# EAGLE design lab (EAGLE 7.7.0)
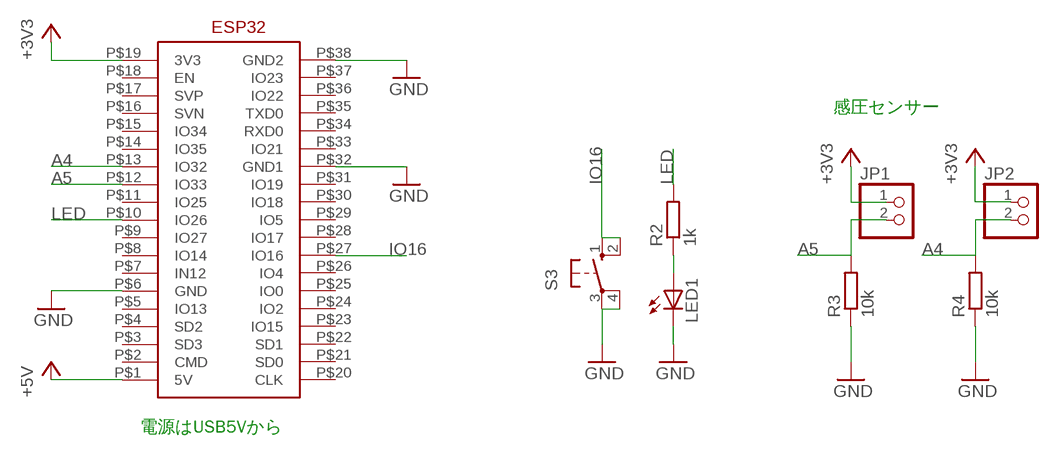
[diagram p0: schematic, sheet 1]

## Parts
JP1  PINHD-1X2  [1X02]
JP2  PINHD-1X2  [1X02]
LED1  LEDSML0603  [SML0603]
R2  1k  R-EU_0207/10  [0207/10]
R3  10k  R-EU_0207/10  [0207/10]
R4  10k  R-EU_0207/10  [0207/10]
S3  10-XX  [B3F-10XX]
U$1  ESP32_DEVKITC  [ESP32_DEVKITC]

## Nets
+3V3: JP1.1 JP2.1 U$1.P$19(3V3)
+5V [VCC]: U$1.P$1(5V)
+5V1 [VCC]: LED1.A R2.1
A4: JP2.2 R4.2 U$1.P$13(IO32)
A5: JP1.2 R3.2 U$1.P$12(IO33)
GND [GND]: LED1.C R3.1 R4.1 S3.3(P) S3.4(P1) U$1.P$6(GND) U$1.P$32(GND1) U$1.P$38(GND2)
IO16: S3.1(S) S3.2(S1) U$1.P$27(IO16)
LED: R2.2 U$1.P$10(IO26)
Unconnected: U$1.P$2(CMD) U$1.P$3(SD3) U$1.P$4(SD2) U$1.P$5(IO13) U$1.P$7(IN12) U$1.P$8(IO14) U$1.P$9(IO27) U$1.P$11(IO25) U$1.P$14(IO35) U$1.P$15(IO34) U$1.P$16(SVN) U$1.P$17(SVP) U$1.P$18(EN) U$1.P$20(CLK) U$1.P$21(SD0) U$1.P$22(SD1) U$1.P$23(IO15) U$1.P$24(IO2) U$1.P$25(IO0) U$1.P$26(IO4) U$1.P$28(IO17) U$1.P$29(IO5) U$1.P$30(IO18) U$1.P$31(IO19) U$1.P$33(IO21) U$1.P$34(RXD0) U$1.P$35(TXD0) U$1.P$36(IO22) U$1.P$37(IO23)

## Notes on the sheet
- 感圧センサー
- 電源はUSB5Vから

## Library data of the parts
JP1 JP2 = pinhead:PINHD-1X2: PIN HEADER
LED1 = led:LED: LED OSRAM: - CHIPLED LG R971, LG N971, LY N971, LG Q971, LY Q971, LO R971, LY R971 LH N974, LH R974 LS Q976, LO Q976, LY Q976 LO Q996 - Hyper CHIPLED LW Q18S LB Q993, LB Q99A, LB R99A - SideLED LS A670, LO A670, LY A670, LG A670, LP A670 LB A673, LV A673, LT A673, LW A673 LH A674 LY A675 LS A676, LA A676, LO A676, LY A676, LW A676 LS A679, LY A679, LG A679 - Hyper Micro SIDELED® LS Y876, LA Y876, LO Y876, LY Y876 LT Y87S - SmartLED LW L88C, LW L88S LB L89C, LB L89S, LG L890 LS L89K, LO L89K, LY L89K LS L896, LA L896, LO L896, LY L896 - TOPLED LS T670, LO T670, LY T670, LG T670, LP T670 LSG T670, LSP T670, LSY T670, LOP T670, LYG T670 LG T671, LOG T671, LSG T671 LB T673, LV T673, LT T673, LW T673 LH T674 LS T676, LA T676, LO T676, LY T676, LB T676, LH T676, LSB T676, LW T676 LB T67C, LV T67C, LT T67C, LS T67K, LO T67K, LY T67K, LW E67C LS E67B, LA E67B, LO E67B, LY E67B, LB E67C, LV E67C, LT E67C LW T67C LS T679, LY T679, LG T679 LS T770, LO T770, LY T770, LG T770, LP T770 LB T773, LV T773, LT T773, LW T773 LH T774 LS E675, LA E675, LY E675, LS T675 LS T776, LA T776, LO T776, LY T776, LB T776 LHGB T686 LT T68C, LB T68C - Hyper Mini TOPLED® LB M676 - Mini TOPLED Santana® LG M470 LS M47K, LO M47K, LY M47K Source: http://www.osram.convergy.de LUXEON: - LUMILED® LXK2-PW12-R00, LXK2-PW12-S00, LXK2-PW14-U00, LXK2-PW14-V00 LXK2-PM12-R00, LXK2-PM12-S00, LXK2-PM14-U00 LXK2-PE12-Q00, LXK2-PE12-R00, LXK2-PE12-S00, LXK2-PE14-T00, LXK2-PE14-U00 LXK2-PB12-K00, LXK2-PB12-L00, LXK2-PB12-M00, LXK2-PB14-N00, LXK2-PB14-P00, LXK2-PB14-Q00 LXK2-PR12-L00, LXK2-PR12-M00, LXK2-PR14-Q00, LXK2-PR14-R00 LXK2-PD12-Q00, LXK2-PD12-R00, LXK2-PD12-S00 LXK2-PH12-R00, LXK2-PH12-S00 LXK2-PL12-P00, LXK2-PL12-Q00, LXK2-PL12-R00 Source: www.luxeon.com KINGBRIGHT: KA-3528ASYC Source: www.kingbright.com
R2-R4 = rcl:R-EU_: RESISTOR, European symbol
S3 = switch-omron:10-XX: OMRON SWITCH; MPN: B3F-1000; OC_FARNELL: 176432; OC_NEWARK: 36M3542
U$1 = esp32-devkit:ESP32_DEVKITC

## Board
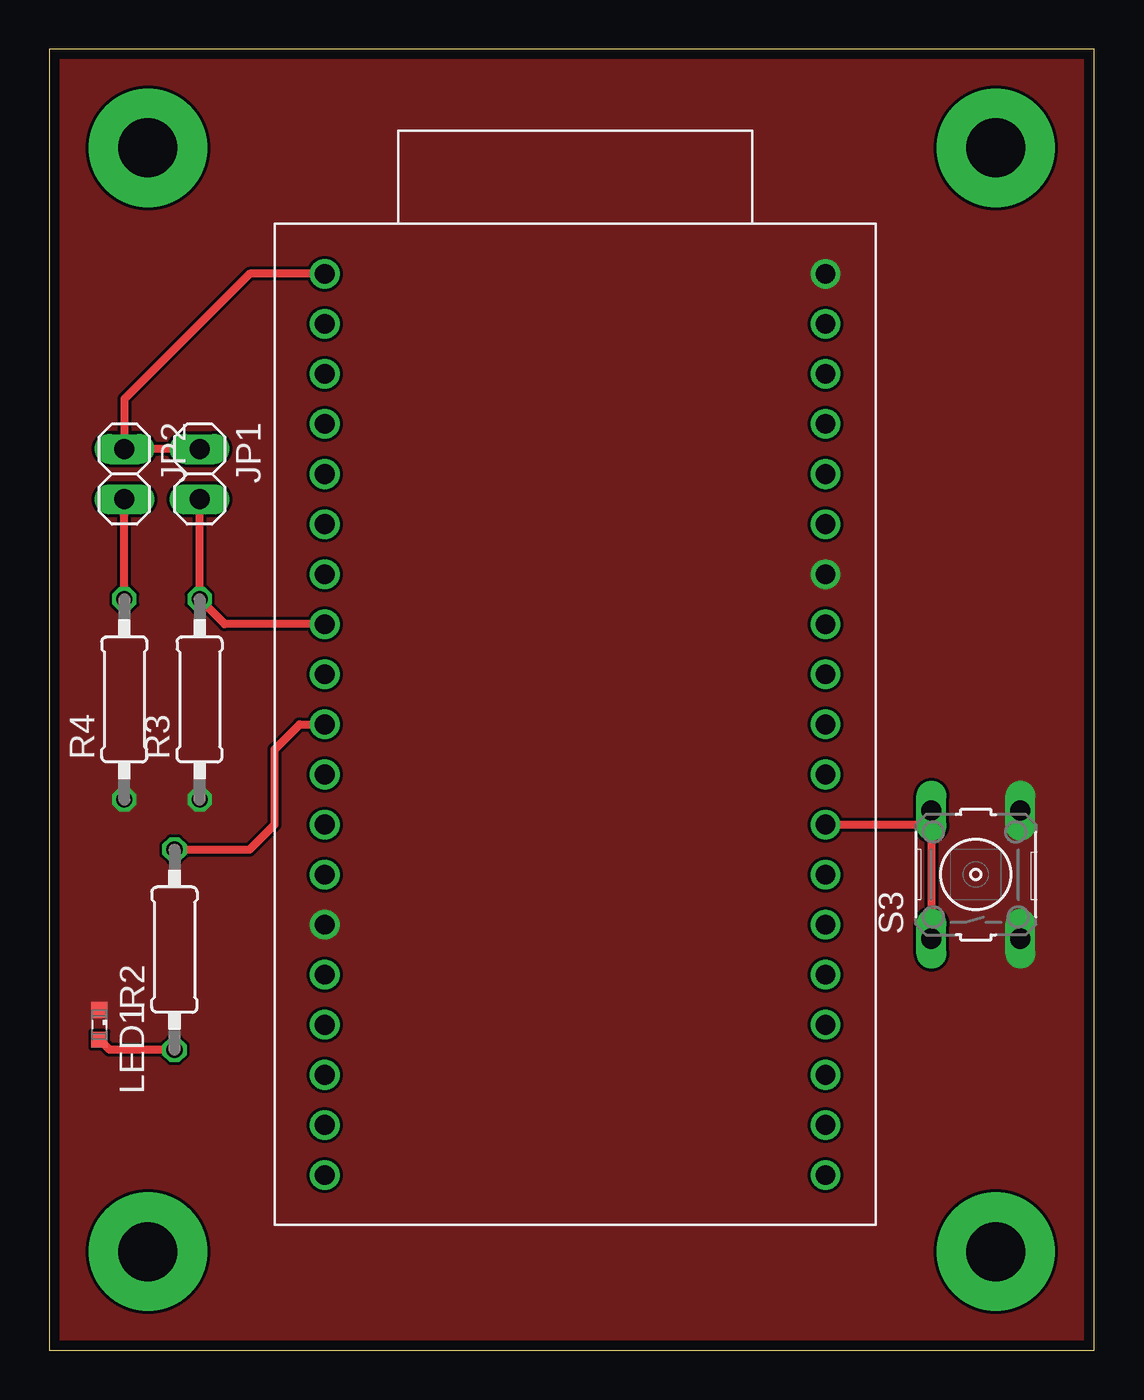
[diagram p1: board, top side]
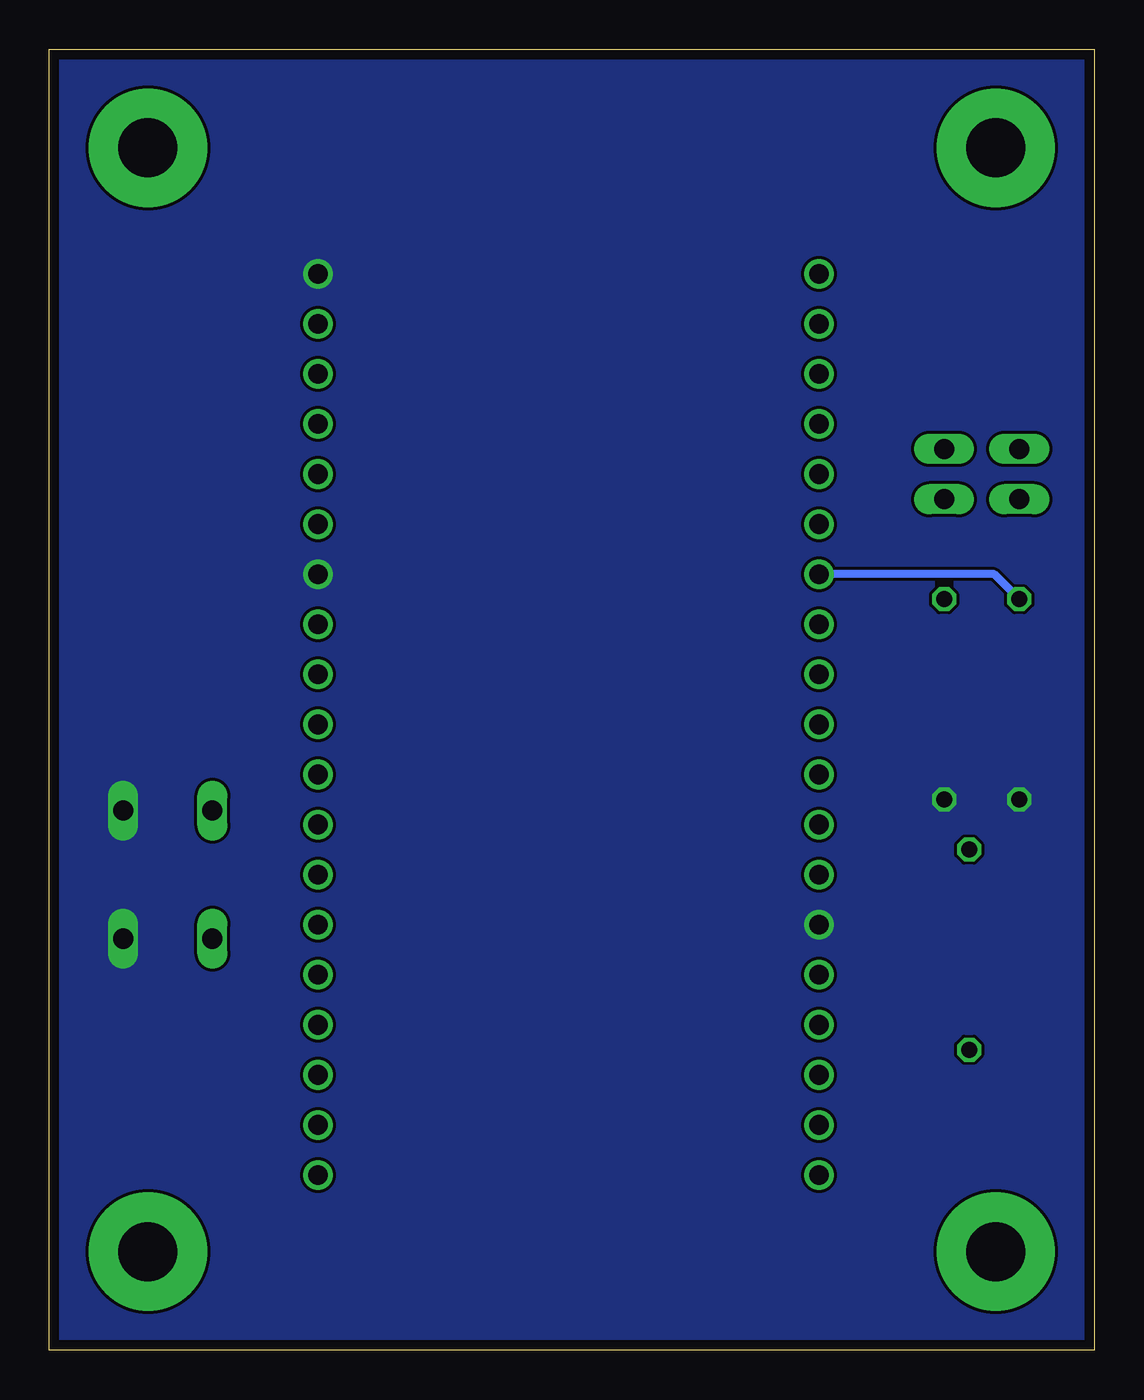
[diagram p2: board, bottom side, seen from below]

Size 53 x 66 mm. Coordinates in mm from the lower left corner, seen from the top.
Outline: 0,0 53,0 53,66 0,66 0,0
Copper layers (1*16): Top 0.035mm / dielectric 1.6mm / Bottom 0.035mm
Design rules "Elecrow_2-layer_PCB_eagle_rule": minimum track width 6mil, minimum drill 12mil, track to track 6mil, track to pad 6mil, pad to pad 6mil, via to via 8mil, smd to smd 0mil, copper to edge 20mil, drill to drill 10mil, minimum pad ring 6mil, minimum via ring 6mil, stop-mask expansion 0mil, vias tented up to drill 100mil, thermal gap 10mil

### Footprints (pad centres in the part's own frame; a part is rotated, then mirrored left to right if it is on the bottom)
1X02 = drill 1.016 long: 1 -1.27,0; 2 1.27,0
SML0603 = smd 0.8 x 0.8: A 0.75,0; C -0.75,0
0207/10 = drill 0.813 octagon: 1 -5.08,0; 2 5.08,0
B3F-10XX = drill 1.016 long: 1 -3.251,2.261; 2 3.251,2.261; 3 -3.251,-2.261; 4 3.251,-2.261
ESP32_DEVKITC = drill 1: P$1 -12.7,-21.59; P$2 -12.7,-19.05; P$3 -12.7,-16.51; P$4 -12.7,-13.97; P$5 -12.7,-11.43; P$6 -12.7,-8.89; P$7 -12.7,-6.35; P$8 -12.7,-3.81; P$9 -12.7,-1.27; P$10 -12.7,1.27; P$11 -12.7,3.81; P$12 -12.7,6.35; P$13 -12.7,8.89; P$14 -12.7,11.43; P$15 -12.7,13.97; P$16 -12.7,16.51; P$17 -12.7,19.05; P$18 -12.7,21.59; P$19 -12.7,24.13; P$20 12.7,-21.59; P$21 12.7,-19.05; P$22 12.7,-16.51; P$23 12.7,-13.97; P$24 12.7,-11.43; P$25 12.7,-8.89; P$26 12.7,-6.35; P$27 12.7,-3.81; P$28 12.7,-1.27; P$29 12.7,1.27; P$30 12.7,3.81; P$31 12.7,6.35; P$32 12.7,8.89; P$33 12.7,11.43; P$34 12.7,13.97; P$35 12.7,16.51; P$36 12.7,19.05; P$37 12.7,21.59; P$38 12.7,24.13

### Placement (x,y rotation side)
JP1  7.62,44.45 270 top
JP2  3.81,44.45 270 top
LED1  2.54,16.51 270 top
R2  6.35,20.32 90 top
R3  7.62,33.02 90 top
R4  3.81,33.02 90 top
S3  46.99,24.13 90 top
U$1  26.67,30.48 0 top

### Tracks (layer width: path | path; a pad name or v marks a point on that pad's centre or on a via)
+3V3
  Top 0.406: U$1.P$19 10.16,54.61 3.81,48.26 JP2.1 JP1.1
+5V1
  Top 0.406: R2.1 3.06,15.24 LED1.A
A4
  Top 0.406: R4.2 JP2.2
  Bottom 0.406: R4.2 5.08,39.37 U$1.P$13
A5
  Top 0.406: JP1.2 R3.2 8.89,36.83 U$1.P$12
GND
  pour Bottom (no thermals): -10.16,58.42 -10.16,-5.08 64.77,-5.08 64.77,76.2 -1.27,76.2 -10.16,76.2
  pour Top (no thermals): -6.35,53.34 -6.35,-2.54 58.42,-2.54 58.42,71.12 17.78,71.12 -6.35,71.12
IO16
  Top 0.406: U$1.P$27 44.73,26.67 S3.2 S3.1
LED
  Top 0.406: R2.2 10.16,25.4 11.43,26.67 11.43,30.48 12.7,31.75 U$1.P$10
N$1  (via drill 3 pad 6)
  other vias: 5,5
N$2  (via drill 3 pad 6)
  other vias: 48,5
N$3  (via drill 3 pad 6)
  other vias: 48,61
N$4  (via drill 3 pad 6)
  other vias: 5,61